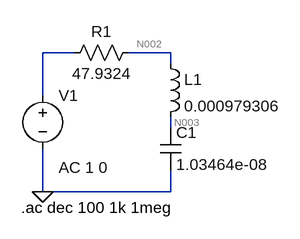
[diagram p0: schematic fig5_65.asc]
fig5_65.asc, the LTspice schematic file:
Version 4.1
SHEET 1 880 680
WIRE 16 80 -32 80
WIRE 160 80 96 80
WIRE 160 96 160 80
WIRE -32 144 -32 80
WIRE 160 192 160 176
WIRE -32 288 -32 224
WIRE 160 288 160 256
WIRE 160 288 -32 288
FLAG -32 288 0
SYMBOL voltage -32 128 R0
WINDOW 123 24 124 Left 2
WINDOW 39 0 0 Left 0
SYMATTR InstName V1
SYMATTR Value2 AC 1 0
SYMATTR Value ""
SYMBOL res 112 64 R90
WINDOW 0 0 56 VBottom 2
WINDOW 3 32 56 VTop 2
SYMATTR InstName R1
SYMATTR Value 47.9324
SYMBOL ind 144 80 R0
SYMATTR InstName L1
SYMATTR Value 0.000979306
SYMATTR SpiceLine Rser=0
SYMBOL cap 144 192 R0
SYMATTR InstName C1
SYMATTR Value 1.03464e-08
TEXT -64 312 Left 2 !.ac dec 100 1k 1meg

The netlist it stands for:
* fig5_65.asc
V1 N001 0 AC 1 0
R1 N002 N001 47.9324
L1 N002 N003 0.000979306 Rser=0
C1 N003 0 1.03464e-08
.ac dec 100 1k 1meg
.backanno
.end

* Results of the author's LTspice run, read from the files saved beside the schematic
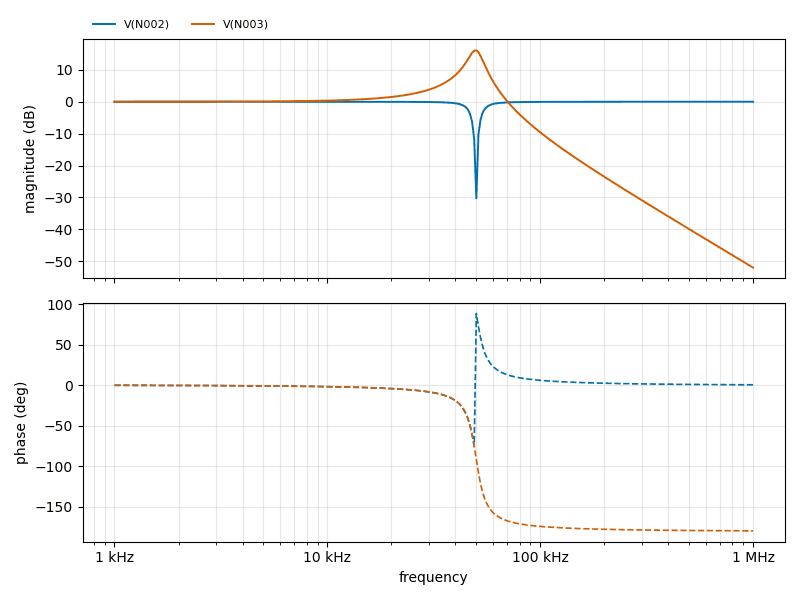
[diagram p1: AC Analysis of fig5_65.asc, plotted from the saved traces]
* AC Analysis, 1 run:
*   V(N002): -0.00 dB at 1 kHz, -0.00 dB at 1 MHz, peak -0.00 dB at 1 kHz, 3 dB below the peak at 46.18 kHz
*   V(N003): 0.00 dB at 1 kHz, -52.02 dB at 1 MHz, peak 16.12 dB at 50.12 kHz, 3 dB below the peak at 45.57 kHz and 53.5 kHz